# EAGLE design version3_PNP (EAGLE 9.3.1)
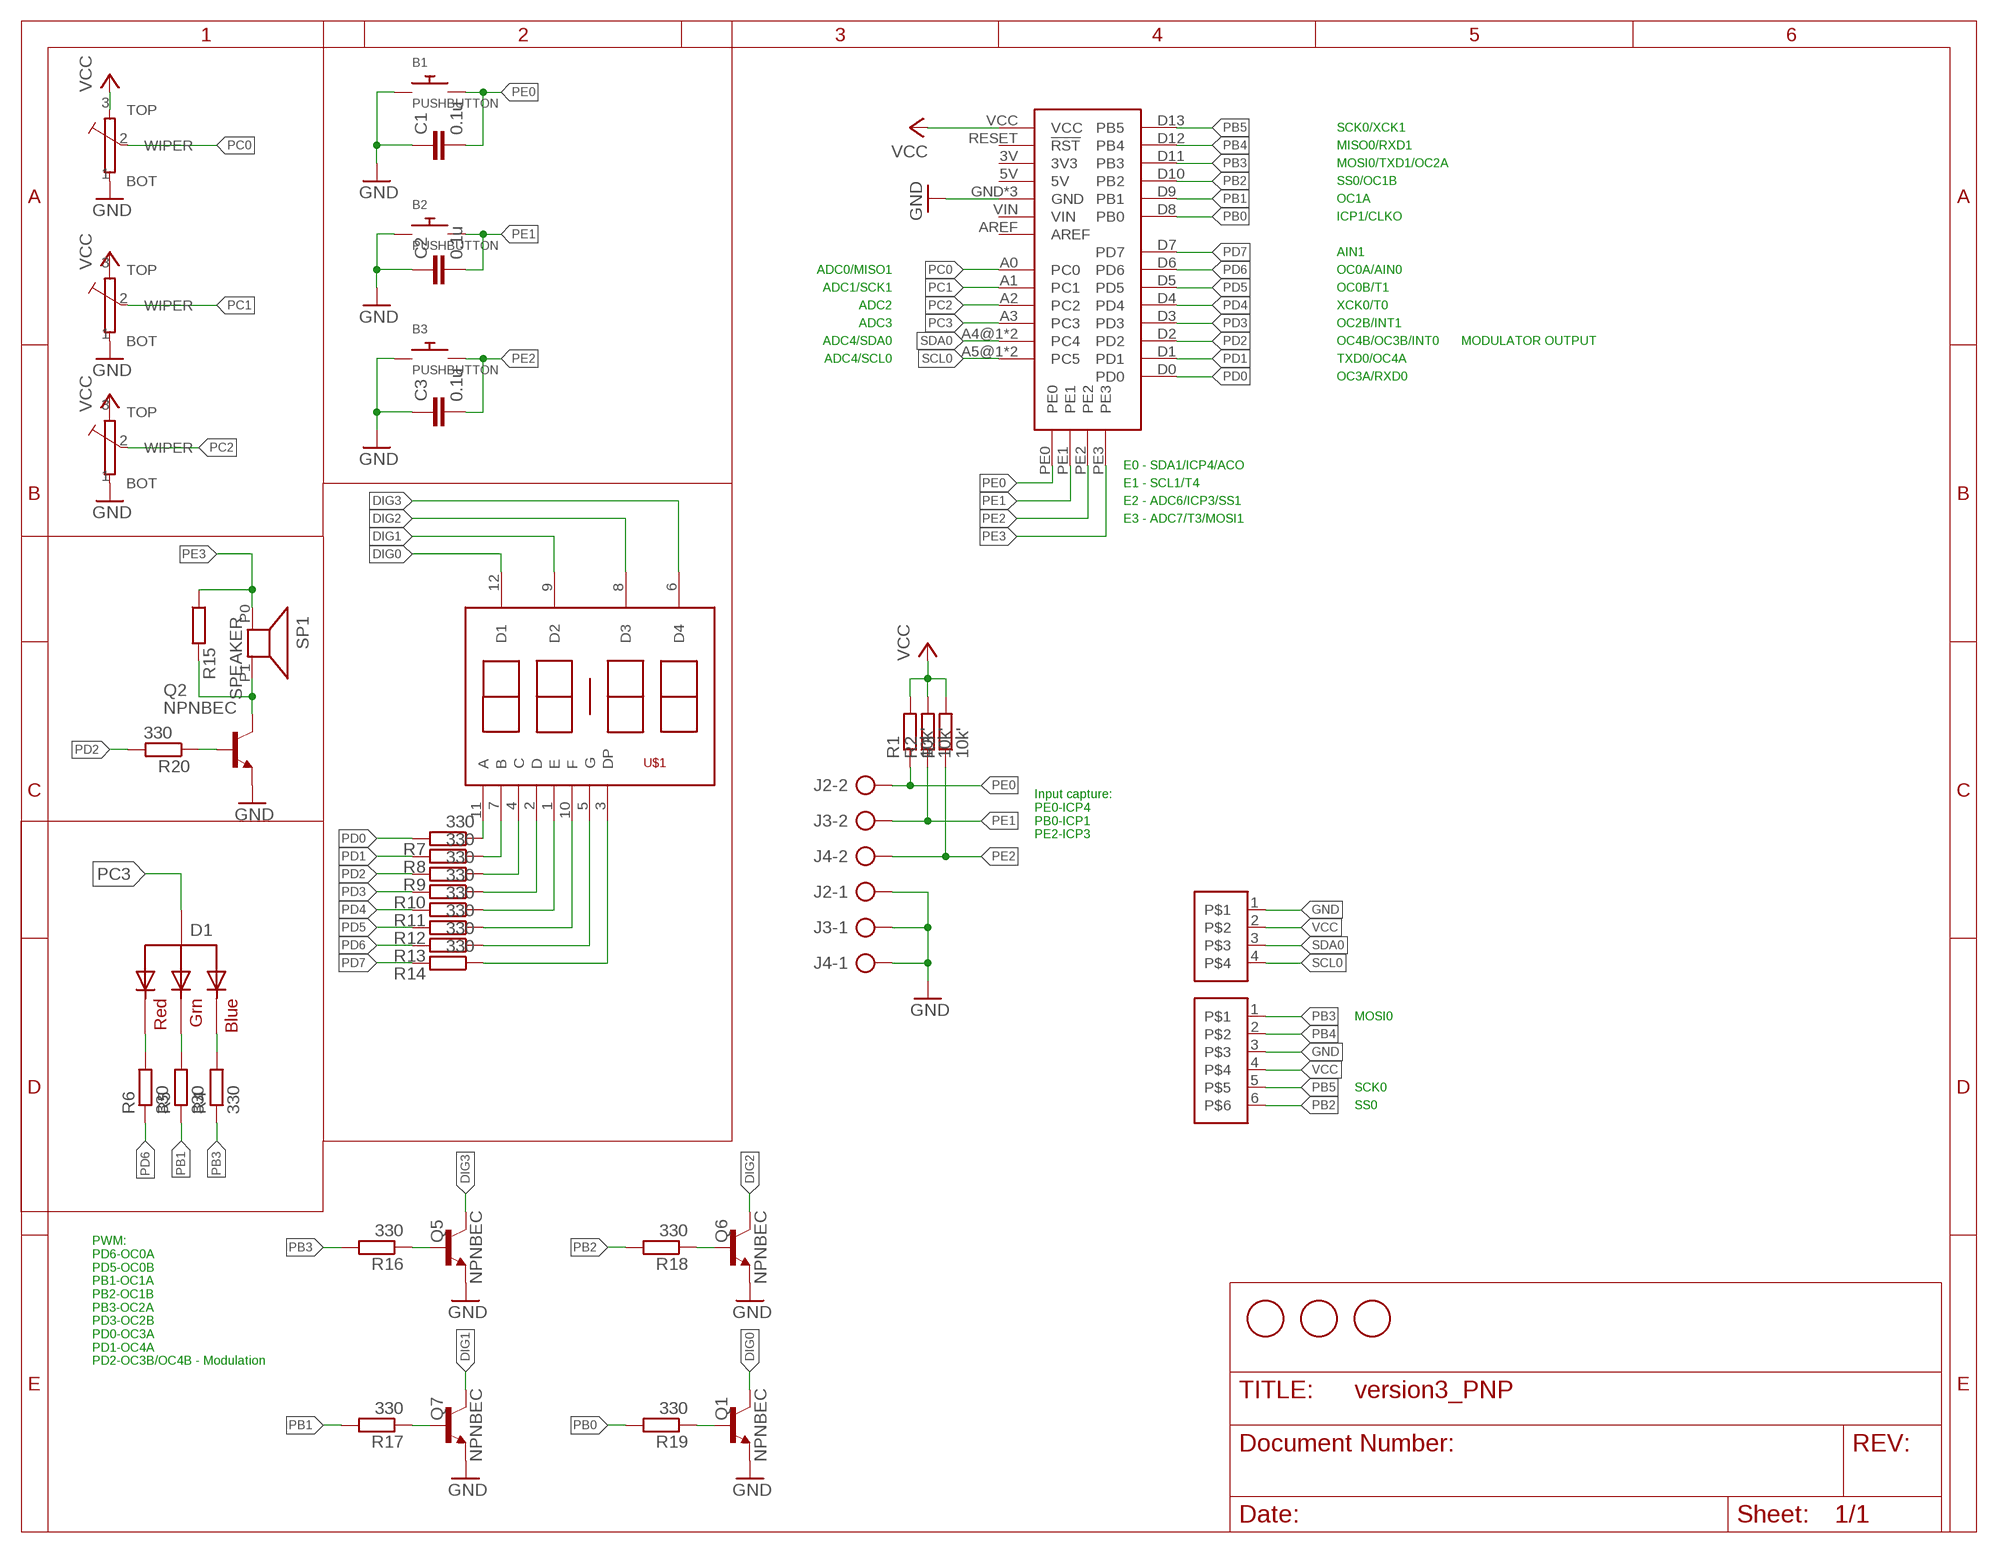
[diagram p0: schematic, sheet 1]

## Parts
AFID1  FIDUCIAL  [FIDUCIAL_1MM]
AFID2  FIDUCIAL  [FIDUCIAL_1MM]
AFID3  FIDUCIAL  [FIDUCIAL_1MM]
B1  PUSHBUTTON  [BUTTON_EVPBF]
B2  PUSHBUTTON  [BUTTON_EVPBF]
B3  PUSHBUTTON  [BUTTON_EVPBF]
C1  0.1u  C-EUC0805  [C0805]
C2  0.1u  C-EUC0805  [C0805]
C3  0.1u  C-EUC0805  [C0805]
D1  RGB_CA  [PLCC-4]
J1  M04F  [1X04_FEMALE]
J2  1X02CLEAN  [1X02_CLEAN]
J3  1X02CLEAN  [1X02_CLEAN]
J4  1X02CLEAN  [1X02_CLEAN]
Q1  NPNBEC  [SOT23]
Q2  NPNBEC  [SOT23]
Q5  NPNBEC  [SOT23]
Q6  NPNBEC  [SOT23]
Q7  NPNBEC  [SOT23]
R1  10k'  R-EU_R0805  [R0805]
R2  10k'  R-EU_R0805  [R0805]
R3  10k'  R-EU_R0805  [R0805]
R4  330  R-EU_R0805  [R0805]
R5  330  R-EU_R0805  [R0805]
R6  330  R-EU_R0805  [R0805]
R7  330  R-EU_R0805  [R0805]
R8  330  R-EU_R0805  [R0805]
R9  330  R-EU_R0805  [R0805]
R10  330  R-EU_R0805  [R0805]
R11  330  R-EU_R0805  [R0805]
R12  330  R-EU_R0805  [R0805]
R13  330  R-EU_R0805  [R0805]
R14  330  R-EU_R0805  [R0805]
R15  R-EU_R0805  [R0805]
R16  330  R-EU_R0805  [R0805]
R17  330  R-EU_R0805  [R0805]
R18  330  R-EU_R0805  [R0805]
R19  330  R-EU_R0805  [R0805]
R20  330  R-EU_R0805  [R0805]
SP1  SPEAKER  [PKMCS_SPEAKER]
TR1  TRIMMTHUMB  [RV09]
TR2  TRIMMTHUMB  [RV09]
TR3  TRIMMTHUMB  [RV09]
U2  XPLAINEDMINI328PB  [XPLAINEDMINI328P]
U$1  4DIG_7SEG_CATHODE  [4DIG_7SEG_CLOCK]
U$2  M06F  [1X06_FEMALE]

## Nets
A: R7.1 U$1.11(A)
B: R8.1 U$1.7(B)
C: R9.1 U$1.4(C)
D: R10.1 U$1.2(D)
DIG0: Q1.3(C) U$1.12(D1)
DIG1: Q7.3(C) U$1.9(D2)
DIG2: Q6.3(C) U$1.8(D3)
DIG3: Q5.3(C) U$1.6(D4)
DP: R14.1 U$1.3(DP)
E: R11.1 U$1.1(E)
F: R12.1 U$1.10(F)
G: R13.1 U$1.5(G)
GND: B1.A1 B1.A2 B2.A1 B2.A2 B3.A1 B3.A2 C1.1 C2.1 C3.1 J1.1 J2.1 J3.1 J4.1 Q1.2(E) Q2.2(E) Q5.2(E) Q6.2(E) Q7.2(E) TR1.1(BOT) TR2.1(BOT) TR3.1(BOT) U2.GND U2.GND1(GND) U2.GND2(GND) U$2.3
N$1: D1.P2(BLUE) R4.2
N$2: D1.P3(GREEN) R5.2
N$3: D1.P4(RED) R6.2
N$4: Q2.3(C) R15.2 SP1.P1
N$5: Q5.1(B) R16.1
N$6: Q1.1(B) R19.1
N$7: Q6.1(B) R18.1
N$8: Q7.1(B) R17.1
N$9: Q2.1(B) R20.1
PB0: R19.2 U2.D8(PB0)
PB1: R5.1 R17.2 U2.D9(PB1)
PB2: R18.2 U2.D10(PB2) U$2.6
PB3: R4.1 R16.2 U2.D11(PB3) U$2.1
PB4: U2.D12(PB4) U$2.2
PB5: U2.D13(PB5) U$2.5
PC0: TR1.2(WIPER) U2.A0(PC0)
PC1: TR2.2(WIPER) U2.A1(PC1)
PC2: TR3.2(WIPER) U2.A2(PC2)
PC3: D1.P1(VCC) U2.A3(PC3)
PD0: R7.2 U2.D0
PD1: R8.2 U2.D1
PD2: R9.2 R20.2 U2.D2
PD3: R10.2 U2.D3
PD4: R11.2 U2.D4
PD5: R12.2 U2.D5
PD6: R6.1 R13.2 U2.D6
PD7: R14.2 U2.D7
PE0: B1.B1 B1.B2 C1.2 J2.2 R1.1 U2.PE0
PE1: B2.B1 B2.B2 C2.2 J3.2 R2.1 U2.PE1
PE2: B3.B1 B3.B2 C3.2 J4.2 R3.1 U2.PE2
PE3: R15.1 SP1.P0 U2.PE3
SCL0: J1.4 U2.A5@1(PC5) U2.A5@2(PC5)
SDA0: J1.3 U2.A4@1(PC4) U2.A4@2(PC4)
VCC [PWR]: J1.2 R1.2 R2.2 R3.2 TR1.3(TOP) TR2.3(TOP) TR3.3(TOP) U2.VCC U$2.4
Unconnected: U2.3V(3V3) U2.5V U2.AREF U2.RESET(!RST) U2.VIN

## Notes on the sheet
- SCK0/XCK1
- MISO0/RXD1
- MOSI0/TXD1/OC2A
- SS0/OC1B
- OC1A
- ICP1/CLKO
- AIN1
- ADC0/MISO1 | OC0A/AIN0
- ADC1/SCK1 | OC0B/T1
- ADC2 | XCK0/T0
- ADC3 | OC2B/INT1
- ADC4/SDA0 | OC4B/OC3B/INT0 | MODULATOR OUTPUT
- ADC4/SCL0 | TXD0/OC4A
- OC3A/RXD0
- E0 - SDA1/ICP4/ACO
- E1 - SCL1/T4
- E2 - ADC6/ICP3/SS1
- E3 - ADC7/T3/MOSI1
- Input capture:
  PE0-ICP4
  PB0-ICP1
  PE2-ICP3
- MOSI0
- SCK0
- SS0
- PWM:
  PD6-OC0A
  PD5-OC0B
  PB1-OC1A
  PB2-OC1B
  PB3-OC2A
  PD3-OC2B
  PD0-OC3A
  PD1-OC4A
  PD2-OC3B/OC4B - Modulation

## Library data of the parts
AFID1-AFID3 = adafruit:FIDUCIAL: For use by pick and place machines to calibrate the vision/machine, 1mm By microbuilder.eu
B1-B3 = XplainedMini328PB:PUSHBUTTON
C1-C3 = rcl:C-EU: CAPACITOR, European symbol; SPICEPREFIX: C
D1 = XplainedMini328PB:RGB_CA
J1 = brv_v6_2:M04
J2-J4 = SimpleHeaders:1X02
Q1 Q2 Q5-Q7 = XplainedMini328PB:NPN
R1-R20 = rcl:R-EU_: RESISTOR, European symbol; SPICEPREFIX: R
SP1 = XplainedMini328PB:SPEAKER
TR1-TR3 = brv_v6_2:TRIMM: TRIMMER
U2 = XplainedMini328PB:XPLAINEDMINI328PB
U$1 = brv_v6_2:4DIG_7SEG_CATHODE
U$2 = brv_v6_2:M06

## Net classes
0 default: width 0.254 mm, drill 0.305 mm, clearance 0.203 mm
1 PWR: width 0.305 mm, drill 0.305 mm, clearance 0.203 mm

## Board
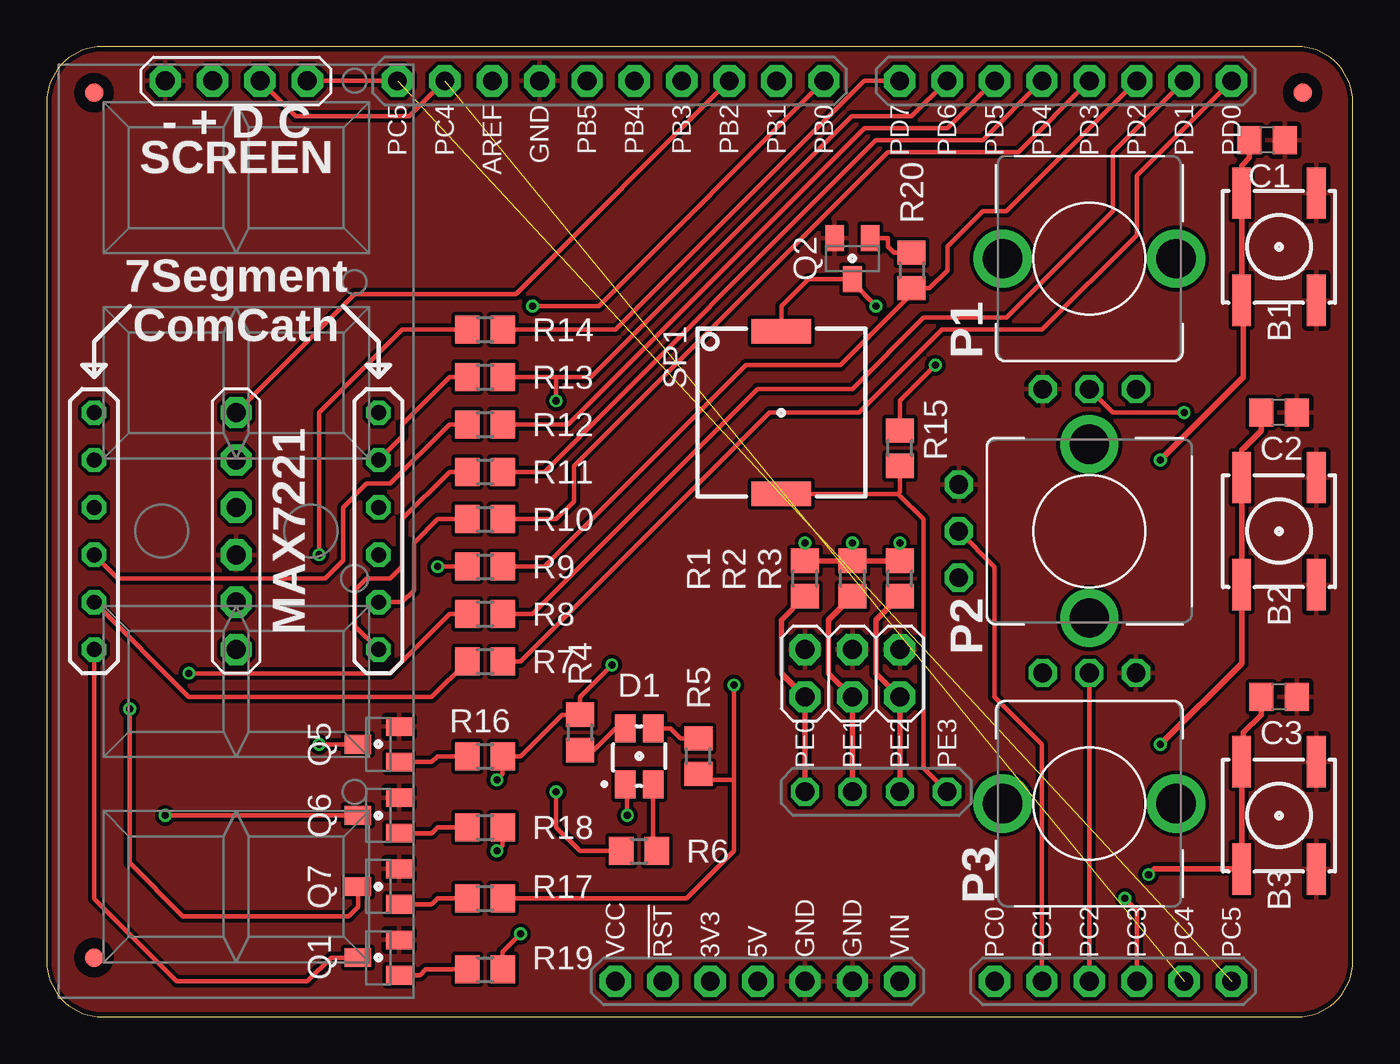
[diagram p1: board, top side]
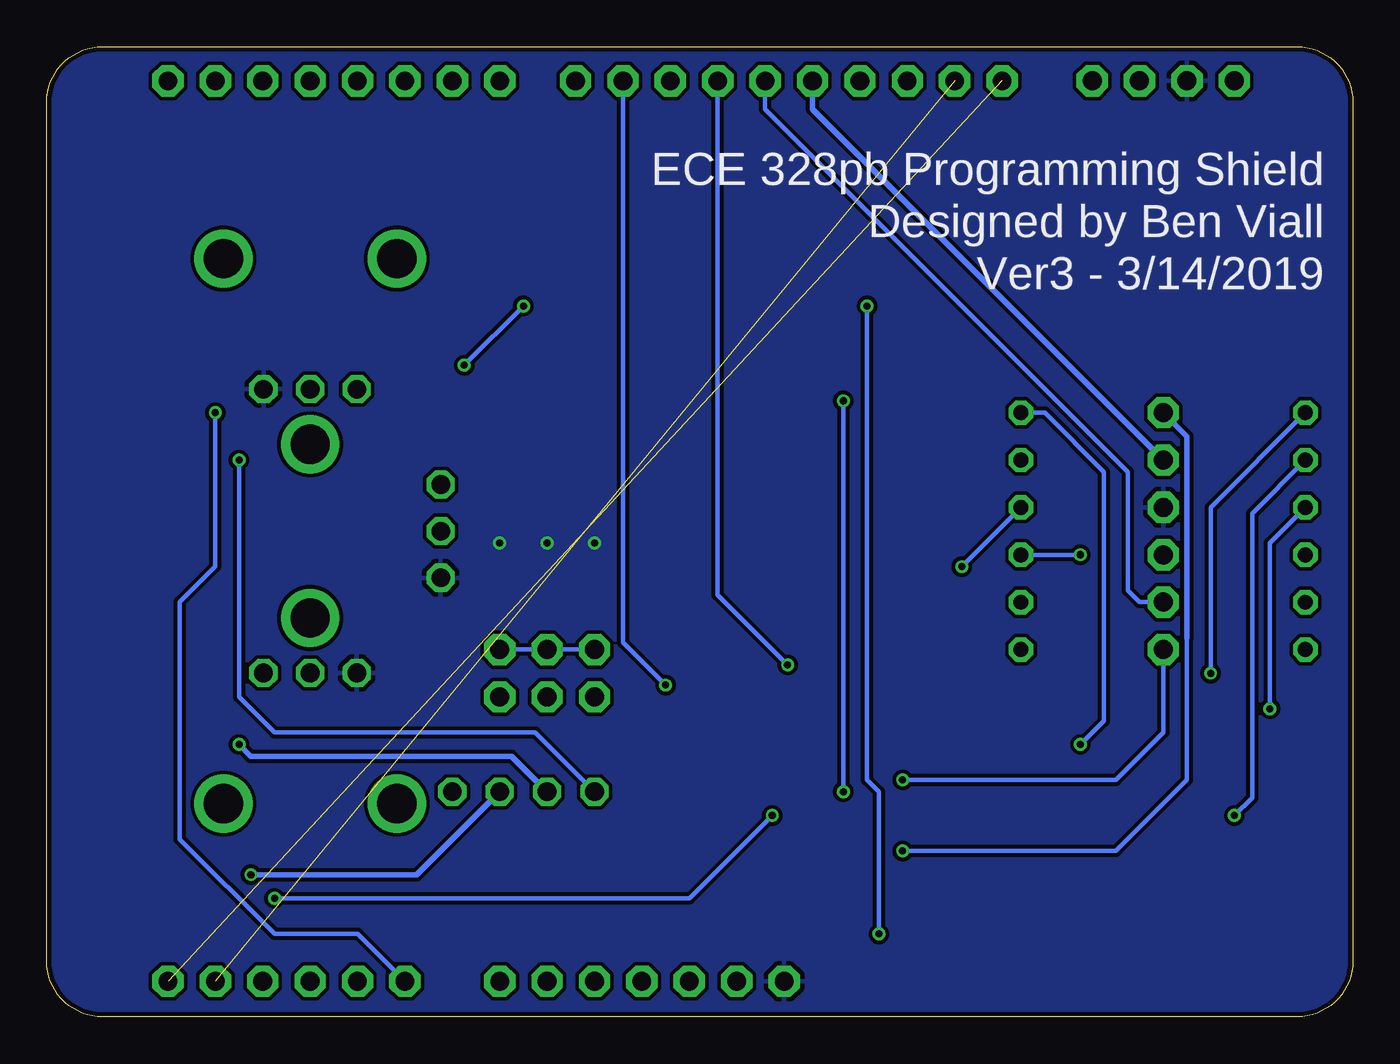
[diagram p2: board, bottom side, seen from below]

Size 70 x 52 mm. Coordinates in mm from the lower left corner, seen from the top.
Outline: 70,3 70,49 arc90 67,52 3,52 arc90 0,49 0,3 arc90 3,0 67,0 arc90 70,3
Copper layers (1*16): Top 0.035mm / dielectric 1.5mm / Bottom 0.035mm
Design rules "Dirty8TS *": minimum track width 8mil, minimum drill 15mil, track to track 8mil, track to pad 8mil, pad to pad 8mil, via to via 8mil, smd to smd 0mil, copper to edge 10mil, drill to drill 10mil, minimum pad ring 10mil, minimum via ring 6mil, stop-mask expansion 2mil, vias tented up to drill 25mil, thermal gap 10mil

### Footprints (pad centres in the part's own frame; a part is rotated, then mirrored left to right if it is on the bottom)
FIDUCIAL_1MM = smd 1 x 1: 1 0,0
BUTTON_EVPBF = smd 2.75 x 1: A1 -2.875,-2; A2 2.875,-2; B1 -2.875,2; B2 2.875,2
C0805 = smd 1.3 x 1.5: 1 -0.95,0; 2 0.95,0
PLCC-4 = smd 1.1 x 1.5: P1 -0.75,-1.5; P2 -0.75,1.5; P3 0.75,1.5; P4 0.75,-1.5
1X04_FEMALE = drill 1.016 pad 1.676 octagon: 1 -3.81,0; 2 -1.27,0; 3 1.27,0; 4 3.81,0
1X02_CLEAN = drill 1.016 pad 1.676 octagon: 1 -1.27,0; 2 1.27,0
SOT23 = smd 1 x 1.4: 1 -0.95,-1.1; 2 0.95,-1.1; 3 0,1.1
R0805 = smd 1.3 x 1.5: 1 -0.95,0; 2 0.95,0
PKMCS_SPEAKER = smd 1.3 x 3.2: P0 -4.35,0; P1 4.35,0
RV09 = drill 1 octagon: 1 -2.5,-7; 2 0,-7; 3 2.5,-7 | drill 2.1 pad 2.4: SHEILD@1 4.65,0 | drill 2.1 pad 2.5: SHIELD@2 -4.65,0
XPLAINEDMINI328P = drill 1 pad 1.676 octagon: 3V 6.35,35.56; 5V 6.35,33.02; A0 6.35,20.32; A1 6.35,17.78; A2 6.35,15.24; A3 6.35,12.7; A4@1 6.35,10.16; A4@2 54.61,49.784; A5@1 6.35,7.62; A5@2 54.61,52.324; AREF 54.61,47.244; D0 54.61,7.62; D1 54.61,10.16; D2 54.61,12.7; D3 54.61,15.24; D4 54.61,17.78; D5 54.61,20.32; D6 54.61,22.86; D7 54.61,25.4; D8 54.61,29.464; D9 54.61,32.004; D10 54.61,34.544; D11 54.61,37.084; D12 54.61,39.624; D13 54.61,42.164; GND 54.61,44.704; GND1 6.35,27.94; GND2 6.35,30.48; RESET 6.35,38.1; VCC 6.35,40.64; VIN 6.35,25.4 | drill 1 octagon: PE0 16.51,30.48; PE1 16.51,27.94; PE2 16.51,25.4; PE3 16.51,22.86
4DIG_7SEG_CLOCK = drill 0.8 octagon: 1 -6.35,-7.62; 2 -3.81,-7.62; 3 -1.27,-7.62; 4 1.27,-7.62; 5 3.81,-7.62; 6 6.35,-7.62; 7 6.35,7.62; 8 3.81,7.62; 9 1.27,7.62; 10 -1.27,7.62; 11 -3.81,7.62; 12 -6.35,7.62
1X06_FEMALE = drill 1.016 pad 1.676 octagon: 1 -6.35,0; 2 -3.81,0; 3 -1.27,0; 4 1.27,0; 5 3.81,0; 6 6.35,0

### Placement (x,y rotation side)
AFID1  2.54,3.17 0 top
AFID2  2.54,49.53 0 top
AFID3  67.31,49.53 0 top
B1  66.04,41.27 90 top
B2  66.04,26.04 90 top
B3  66.04,10.79 90 top
C1  65.41,46.99 180 top
C2  66.04,32.38 180 top
C3  66.04,17.14 180 top
D1  31.75,13.97 0 top
J1  10.16,50.16 0 top
J2  40.64,18.41 270 top
J3  43.18,18.41 270 top
J4  45.72,18.41 270 top
Q1  17.78,3.17 90 top
Q2  43.18,40.64 180 top
Q5  17.78,14.61 90 top
Q6  17.78,10.79 90 top
Q7  17.78,6.99 90 top
R1  40.64,23.5 90 top
R2  43.18,23.5 90 top
R3  45.72,23.5 90 top
R4  28.57,15.24 270 top
R5  34.92,13.97 90 top
R6  31.75,8.89 0 top
R7  23.5,19.05 0 top
R8  23.5,21.59 0 top
R9  23.5,24.13 0 top
R10  23.5,26.67 0 top
R11  23.5,29.21 0 top
R12  23.5,31.75 0 top
R13  23.5,34.29 0 top
R14  23.5,36.83 0 top
R15  45.72,30.48 90 top
R16  23.5,13.97 0 top
R17  23.5,6.35 0 top
R18  23.5,10.16 0 top
R19  23.5,2.54 0 top
R20  46.35,40.01 270 top
SP1  39.37,32.38 90 top
TR1  55.88,40.64 0 top
TR2  55.88,26.04 270 top
TR3  55.88,11.43 180 top
U2  71.12,-4.45 90 top
U$1  10.16,26.04 90 top
U$2  10.16,26.04 90 top

### Tracks (layer width: path | path; a pad name or v marks a point on that pad's centre or on a via)
A
  Top 0.254: R7.1 20.64,17.14 7.62,17.14 U$1.11
B  (via drill 0.38)
  Top 0.254: v7.62,18.41 18.41,18.41 21.59,21.59 R8.1
  Bottom 0.254: U$1.7 7.62,27.3 v7.62,18.41
C  (via drill 0.38)
  Top 0.254: R9.1 v20.95,24.13
  Bottom 0.254: v20.95,24.13 U$1.4
D
  Top 0.254: R10.1 20.95,26.67 19.68,25.4 19.68,22.86 19.05,22.23 U$1.2
DIG0
  Top 0.254: Q1.3 15.24,3.17 13.97,1.91 6.97,1.91 2.54,6.34 U$1.12
DIG1  (via drill 0.38)
  Top 0.254: v4.45,16.51 4.45,8.26 7.3,5.4 16.19,5.4 16.68,5.88 Q7.3
  Bottom 0.254: U$1.9 4.45,25.4 v4.45,16.51
DIG2  (via drill 0.38)
  Top 0.254: Q6.3 v6.35,10.79
  Bottom 0.254: U$1.8 5.4,26.99 5.4,11.75 v6.35,10.79
DIG3  (via drill 0.38)
  Top 0.254: Q5.3 v14.61,14.61
  Bottom 0.254: U$1.6 16.51,32.38 13.34,29.21 13.34,15.88 v14.61,14.61
DP  (via drill 0.38)
  Top 0.254: R14.1 19.05,36.83 14.61,32.38 v14.61,24.77
  Bottom 0.254: v14.61,24.77 U$1.3
E
  Top 0.254: U$1.1 16.51,20.95 16.51,22.86 17.14,23.5 18.4,23.5 19.05,24.14 19.05,26.67 21.59,29.21 R11.1
F
  Top 0.254: U$1.10 3.81,23.5 14.92,23.5 15.88,24.45 15.88,27.3 17.14,28.57 18.41,28.57 21.59,31.75 R12.1
G
  Top 0.254: R13.1 21.59,34.29 19.05,31.75 19.05,31.11 U$1.5
GND
  Bottom 0.254: J2.1 J3.1 J4.1
  pour Top: -0.64,-0.99 -0.64,53.87 70.65,53.87 70.85,-0.99
N$1
  Top 0.254: D1.P2 30.48,15.47 29.3,14.29 R4.2
N$2
  Top 0.254: D1.P3 33.42,15.47 33.98,14.92 R5.2
N$3
  Top 0.254: D1.P4 32.5,9.09 R6.2
N$4  (via drill 0.38)
  Top 0.254: v47.62,34.92 45.72,33.02 R15.2 | v44.45,38.1 43.18,39.37 Q2.3 40.82,39.54 39.37,38.09 SP1.P1
  Bottom 0.254: v44.45,38.1 v47.62,34.92
N$5
  Top 0.254: Q5.1 20.64,13.65 20.95,13.97 R16.1
N$6
  Top 0.254: Q1.1 20,2.23 20.32,2.54 R19.1
N$7
  Top 0.254: Q6.1 20.64,9.85 20.95,10.16 R18.1
N$8
  Top 0.254: Q7.1 20.64,6.04 20.95,6.35 R17.1
N$9
  Top 0.254: R20.1 45.41,40.95 45.09,41.27 45.09,41.74 Q2.1
PB0  (via drill 0.38)
  Top 0.254: U2.D8 29.59,38.1 v26.04,38.1 | R19.2 24.45,3.49 v25.4,4.45
  Bottom 0.254: v25.4,4.45 25.4,12.06 26.04,12.7 v26.04,38.1
PB1  (via drill 0.38)
  Top 0.254: 36.83,12.7 36.83,8.89 34.29,6.35 R17.2 | 36.83,12.7 v36.83,17.78 | R5.1 35.24,12.7 36.83,12.7
  Bottom 0.254: U2.D9 39.12,20.07 v36.83,17.78
PB2  (via drill 0.38)
  Top 0.254: U2.D10 25.15,38.73 16.51,38.73 U$2.6 | v24.13,8.89 24.45,9.21 R18.2
  Bottom 0.254: 8.89,20.32 8.89,12.7 12.7,8.89 v24.13,8.89
  Bottom 0.305: U$2.6 8.89,31.11 8.89,20.32
PB3  (via drill 0.38)
  Top 0.254: v30.29,18.86 28.57,17.14 R4.1 27.62,16.19 25.4,13.97 R16.2 24.45,13.02 v24.13,12.7
  Bottom 0.254: U$2.1 10.16,15.24 12.7,12.7 v24.13,12.7 | U2.D11 34.04,22.61 v30.29,18.86
PB4
  Bottom 0.254: U2.D12 31.5,48.64 12.06,29.21 12.06,22.86 11.43,22.23 U$2.2
PB5
  Bottom 0.305: U$2.5 28.96,48.64 U2.D13
PC0  (via drill 0.38)
  Top 0.254: TR1.2 57.13,32.38 v60.96,32.38
  Bottom 0.254: v60.96,32.38 60.96,24.13 62.87,22.23 62.87,9.53 57.78,4.45 53.34,4.45 U2.A0
PC1
  Top 0.254: U2.A1 53.34,14.61 50.8,17.14 50.8,24.11 TR2.2
PC2
  Top 0.254: TR3.2 U2.A2
PC3  (via drill 0.38)
  Top 0.254: D1.P1 31.11,12.36 v31.11,10.79 | v57.78,6.35 58.42,5.71 U2.A3
  Bottom 0.254: v31.11,10.79 35.56,6.35 v57.78,6.35
PD0
  Top 0.254: U2.D0 58.42,45.09 58.42,41.91 53.34,36.83 47.98,36.83 43.54,32.38 38.73,32.38 25.4,19.05 R7.2
PD1
  Top 0.254: U2.D1 57.15,46.35 57.15,43.18 51.44,37.47 46.99,37.47 43.18,33.66 38.1,33.66 26.04,21.59 R8.2
PD2
  Top 0.254: U2.D2 51.44,43.18 50.17,43.18 48.26,41.27 48.26,40.01 47.31,39.05 R20.2 46.35,38.73 42.55,34.92 37.47,34.92 26.67,24.13 R9.2
PD3
  Top 0.254: R10.2 27.3,26.67 28.26,27.62 28.26,29.53 45.09,46.35 52.07,46.35 U2.D3
PD4
  Top 0.254: U2.D4 50.16,46.99 44.45,46.99 26.67,29.21 R11.2
PD5
  Top 0.254: U2.D5 48.26,47.62 43.81,47.62 27.94,31.75 R12.2
PD6  (via drill 0.38)
  Top 0.254: U2.D6 46.35,48.26 43.15,48.26 29.18,34.29 27.3,34.29 | R13.2 27.3,34.29 | v27.3,33.02 27.3,34.29 | R6.1 28.57,8.89 27.3,10.16 v27.3,12.06
  Bottom 0.254: v27.3,33.02 v27.3,12.06
PD7
  Top 0.254: U2.D7 43.81,50.16 30.48,36.83 R14.2
PE0  (via drill 0.38)
  Top 0.305: U2.PE0 J2.2 39.37,18.41 39.37,21.27 R1.1 | C1.2 64.45,46.04 64.04,45.62 B1.B2 64.04,38.73 | 64.04,38.73 B1.B1 | v59.69,29.84 64.14,34.29 64.14,38.64 64.04,38.73
  Bottom 0.254: U2.PE0 43.81,15.24 57.78,15.24 59.69,17.14 v59.69,29.84
PE1  (via drill 0.38)
  Top 0.305: U2.PE1 J3.2 41.91,18.41 41.91,21.27 R2.1 | C2.2 65.09,31.43 64.04,30.39 B2.B2 B2.B1 64.04,18.95 v59.69,14.61
  Bottom 0.305: U2.PE1 45.09,13.97 59.05,13.97 v59.69,14.61
PE2  (via drill 0.38)
  Top 0.305: U2.PE2 J4.2 44.45,18.41 44.45,21.27 R3.1 | C3.2 65.09,16.2 64.14,15.24 64.14,13.77 B3.B2 B3.B1 59.35,7.92 v59.05,7.62
  Bottom 0.305: U2.PE2 50.16,7.62 v59.05,7.62
PE3
  Top 0.254: U2.PE3 46.99,13.34 46.99,26.67 45.62,28.04 | SP1.P0 45.62,28.04 | R15.1 45.72,28.13 45.62,28.04
SCL0  (1 unrouted)
  Top 0.254: J1.4 U2.A5@2
SDA0  (1 unrouted)
  Top 0.254: J1.3 13.34,48.26 19.43,48.26 U2.A4@2
VCC  (via drill 0.38)
  Top 0.305: R2.2 R1.2 v40.64,25.4 | R2.2 R3.2 v45.72,25.4 | R2.2 v43.18,25.4
  pour Bottom: -1.27,-0.99 -1.27,52.7 71.85,52.7 71.85,-0.99

### Text on the board
tPlace: - + D C | SCREEN | P1 | 7Segment / ComCath | MAX7221 | P2 | P3
bPlace: ECE 328pb Programming Shield | Designed by Ben Viall | Ver3 - 3/14/2019